# EAGLE design Shield_v2 (EAGLE 9.6.2)
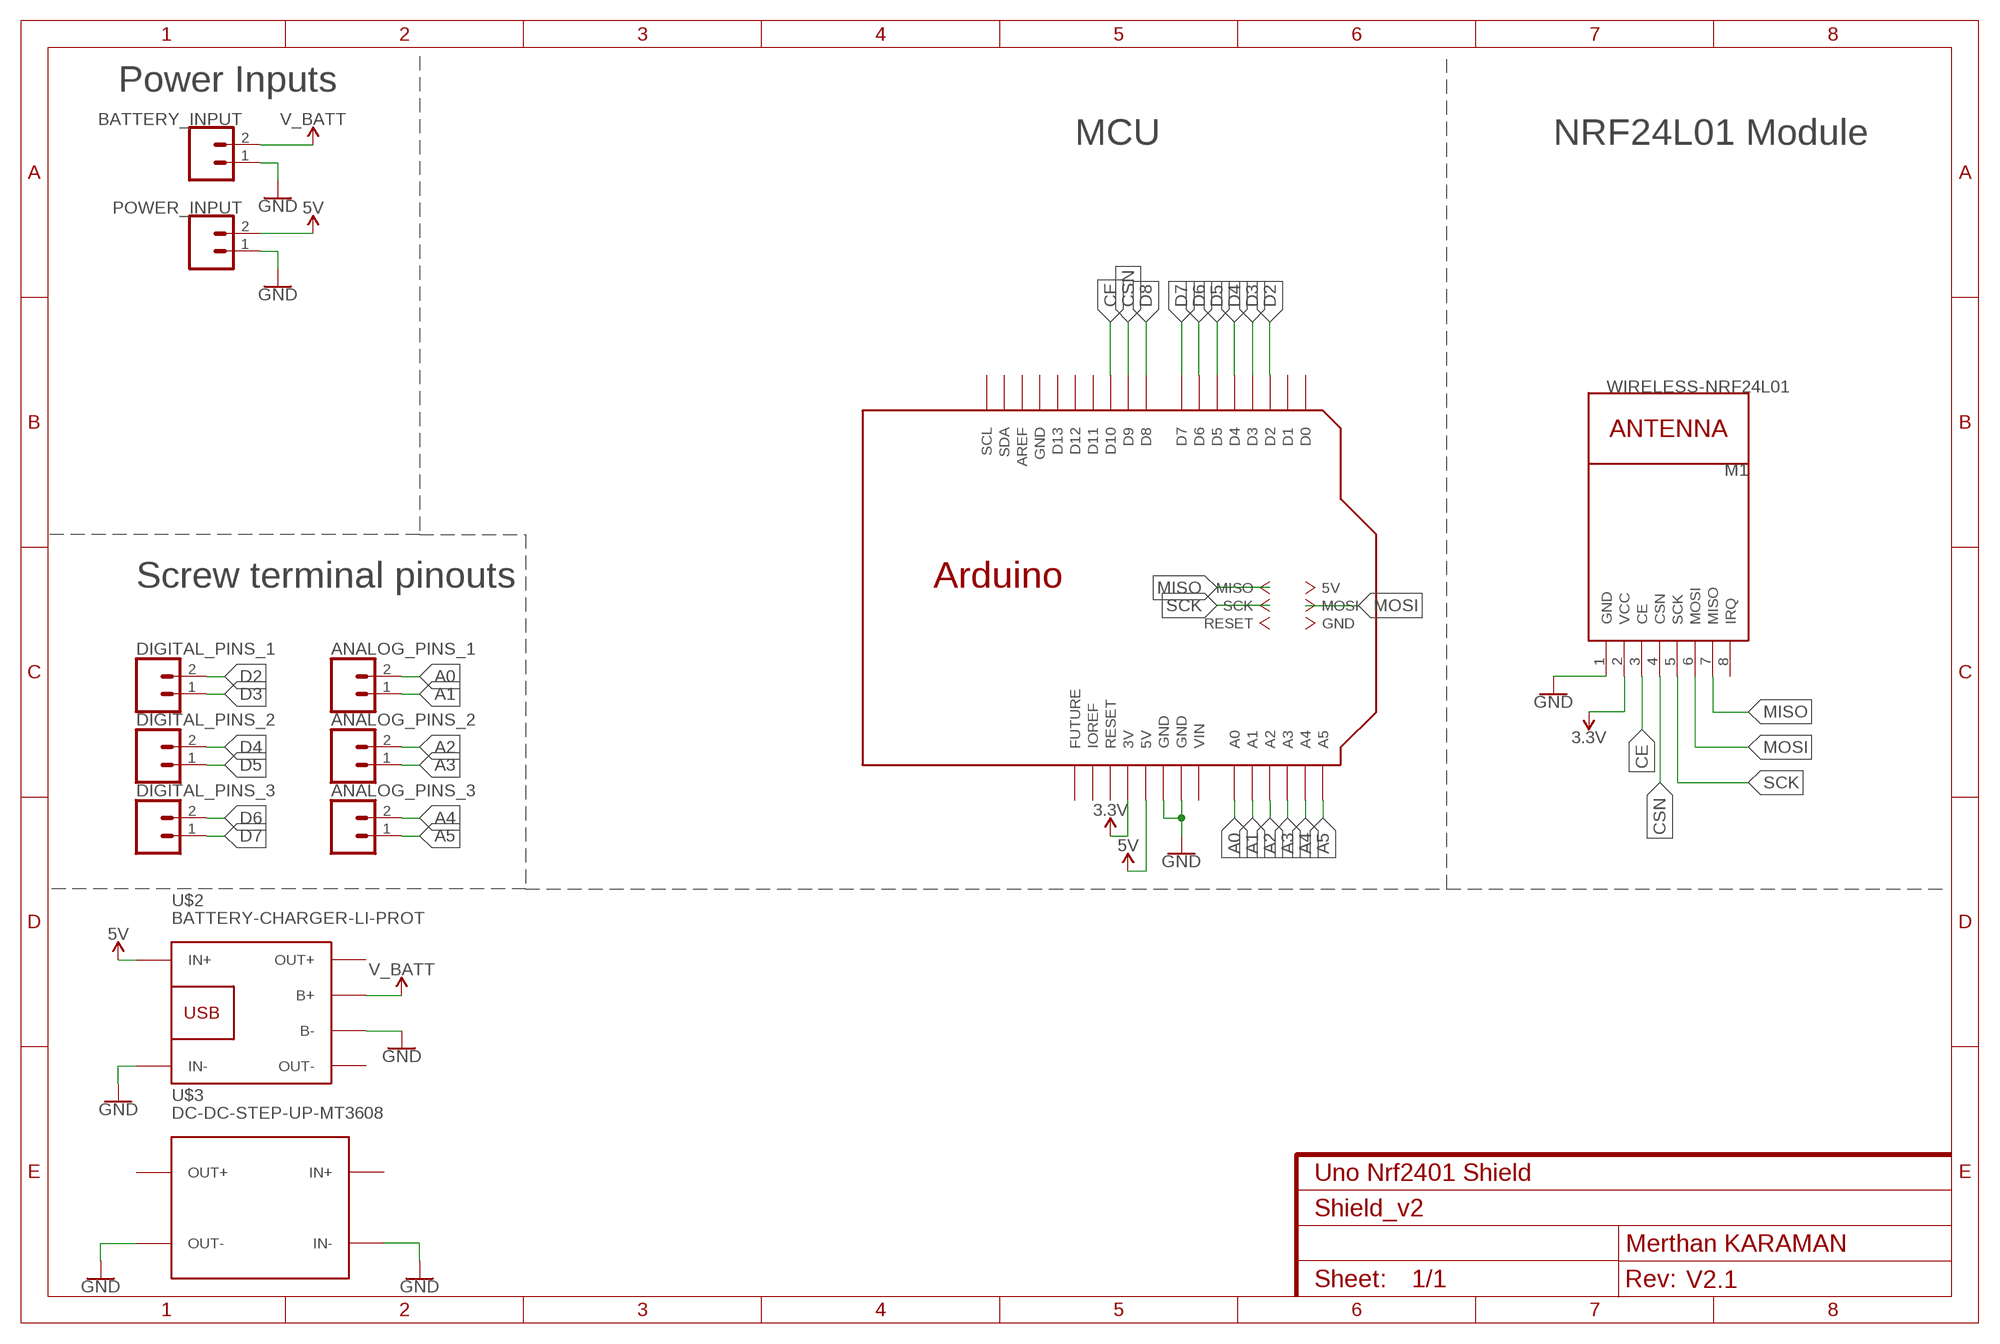
[diagram p0: schematic, sheet 1]
FRAME1 (FRAME-A4L): CNAME: Uno Nrf2401 Shield; CREVISION: V2.1; DESIGNER: Merthan KARAMAN

## Parts
ANALOG_PINS_1  CONN_025MM  [SCREWTERMINAL-5MM-2]
ANALOG_PINS_2  CONN_025MM  [SCREWTERMINAL-5MM-2]
ANALOG_PINS_3  CONN_025MM  [SCREWTERMINAL-5MM-2]
BATTERY_INPUT  CONN_025MM  [SCREWTERMINAL-5MM-2]
DIGITAL_PINS_1  CONN_025MM  [SCREWTERMINAL-5MM-2]
DIGITAL_PINS_2  CONN_025MM  [SCREWTERMINAL-5MM-2]
DIGITAL_PINS_3  CONN_025MM  [SCREWTERMINAL-5MM-2]
M1  WIRELESS-NRF24L01  [WIRELESS-NRF24L01]
POWER_INPUT  CONN_025MM  [SCREWTERMINAL-5MM-2]
U$1  ARDUINO-WITH-ISP  [ARDUINO-WITH-ISP]
U$2  BATTERY-CHARGER-LI-PROT  [BATTERY-CHARGER-LI-PROT]
U$3  DC-DC-STEP-UP-MT3608  [DC-DC-STEP-UP-MT3608]

## Nets
3.3V: M1.2(VCC) U$1.3V
5V: POWER_INPUT.2 U$1.5V U$2.IN+
A0: ANALOG_PINS_1.2 U$1.A0
A1: ANALOG_PINS_1.1 U$1.A1
A2: ANALOG_PINS_2.2 U$1.A2
A3: ANALOG_PINS_2.1 U$1.A3
A4: ANALOG_PINS_3.2 U$1.A4
A5: ANALOG_PINS_3.1 U$1.A5
CE: M1.3(CE) U$1.D10
CSN: M1.4(CSN) U$1.D9
D2: DIGITAL_PINS_1.2 U$1.D2
D3: DIGITAL_PINS_1.1 U$1.D3
D4: DIGITAL_PINS_2.2 U$1.D4
D5: DIGITAL_PINS_2.1 U$1.D5
D6: DIGITAL_PINS_3.2 U$1.D6
D7: DIGITAL_PINS_3.1 U$1.D7
D8: U$1.D8
GND: BATTERY_INPUT.1 M1.1(GND) POWER_INPUT.1 U$1.GND$2(GND) U$1.GND$3(GND) U$2.B- U$2.IN- U$3.IN- U$3.OUT-
MISO: M1.7(MISO) U$1.MISO
MOSI: M1.6(MOSI) U$1.MOSI
SCK: M1.5(SCK) U$1.SCK
V_BATT: BATTERY_INPUT.2 U$2.B+
Unconnected: M1.8(IRQ) U$1.5V@2(5V) U$1.AREF U$1.D0 U$1.D1 U$1.D11 U$1.D12 U$1.D13 U$1.GND@3(GND) U$1.IOREF U$1.RESERVED(FUTURE) U$1.RESET U$1.RESET@1(RESET) U$1.SCL U$1.SDA U$2.OUT+ U$2.OUT- U$3.IN+ U$3.OUT+

## Notes on the sheet
- Power Inputs
- MCU | NRF24L01 Module
- Screw terminal pinouts

## Power pins joined to a net without a drawn wire
GND: U$1.GND
VIN: U$1.VIN

## Library data of the parts
ANALOG_PINS_1-ANALOG_PINS_3 BATTERY_INPUT DIGITAL_PINS_1-DIGITAL_PINS_3 POWER_INPUT = SparkFun-Connectors:CONN_02: Multi connection point. Often used as Generic Header-pin footprint for 0.1 inch spaced/style header connections On any of the 0.1 inch spaced packages, you can populate with these: Break Away Headers - Straight <https://www.sparkfun.com/products/116> (PRT-00116) Break Away Male Headers - Right Angle <https://www.sparkfun.com/products/553> (PRT-00553) Female Headers <https://www.sparkfun.com/products/115> (PRT-00115) Break Away Headers - Machine Pin <https://www.sparkfun.com/products/117> (PRT-00117) Break Away Female Headers - Swiss Machine Pin <https://www.sparkfun.com/products/743> (PRT-00743) For SCREWTERMINALS and SPRING TERMINALS visit here: Screw Terimnals on SparkFun.com <https://www.sparkfun.com/search/results?term=Screw+Terminals> (5mm/3.5mm/2.54mm spacing) This device is also useful as a general connection point to wire up your design to another part of your project. Our various solder wires solder well into these plated through hole pads. Hook-Up Wire - Assortment (Stranded, 22 AWG) <https://www.sparkfun.com/products/11375> (PRT-11375) Hook-Up Wire - Assortment (Solid Core, 22 AWG) <https://www.sparkfun.com/products/11367> (PRT-11367) View the entire wire category on our website here <https://www.sparkfun.com/categories/141> Special notes: Molex polarized connector foot print use with: PRT-08233 with associated crimp pins and housings. 2.54_SCREWTERM for use with PRT-10571. 3.5mm Screw Terminal footprints for PRT-08084 5mm Screw Terminal footprints for use with PRT-08432; SF_SKU: PRT-08432
M1 = diy-modules:WIRELESS-NRF24L01: 2.4 GHz Wireless Module based on NRF24L01 chip More details available here: http://www.electrodragon.com/w/NRF24L01 Click here to find device on ebay.com <http://www.ebay.com/sch/nrf24l01+arduino>
U$1 = El_yapimi:ARDUINO-WITH-ISP
U$2 = diy-modules:BATTERY-CHARGER-LI-PROT: Lithium Battery 5V Charger with protection circuit More details available here: http://www.instructables.com/id/DIY-Lithium-ion-Battery-Charger/step4/TP4056-based-lithium-ion-battery-charger-module/ Click here to find device on ebay.com <http://www.ebay.com/sch/tp4056+charger+usb+protection>
U$3 = diy-modules:DC-DC-STEP-UP-MT3608: DC/DC Step-Up Regulator based on MT3608 chip MT3608 datasheet available here: https://www.olimex.com/Products/Breadboarding/BB-PWR-3608/resources/MT3608.pdf Click here to find device on ebay.com <http://www.ebay.com/sch/mt3608+module>

## Board
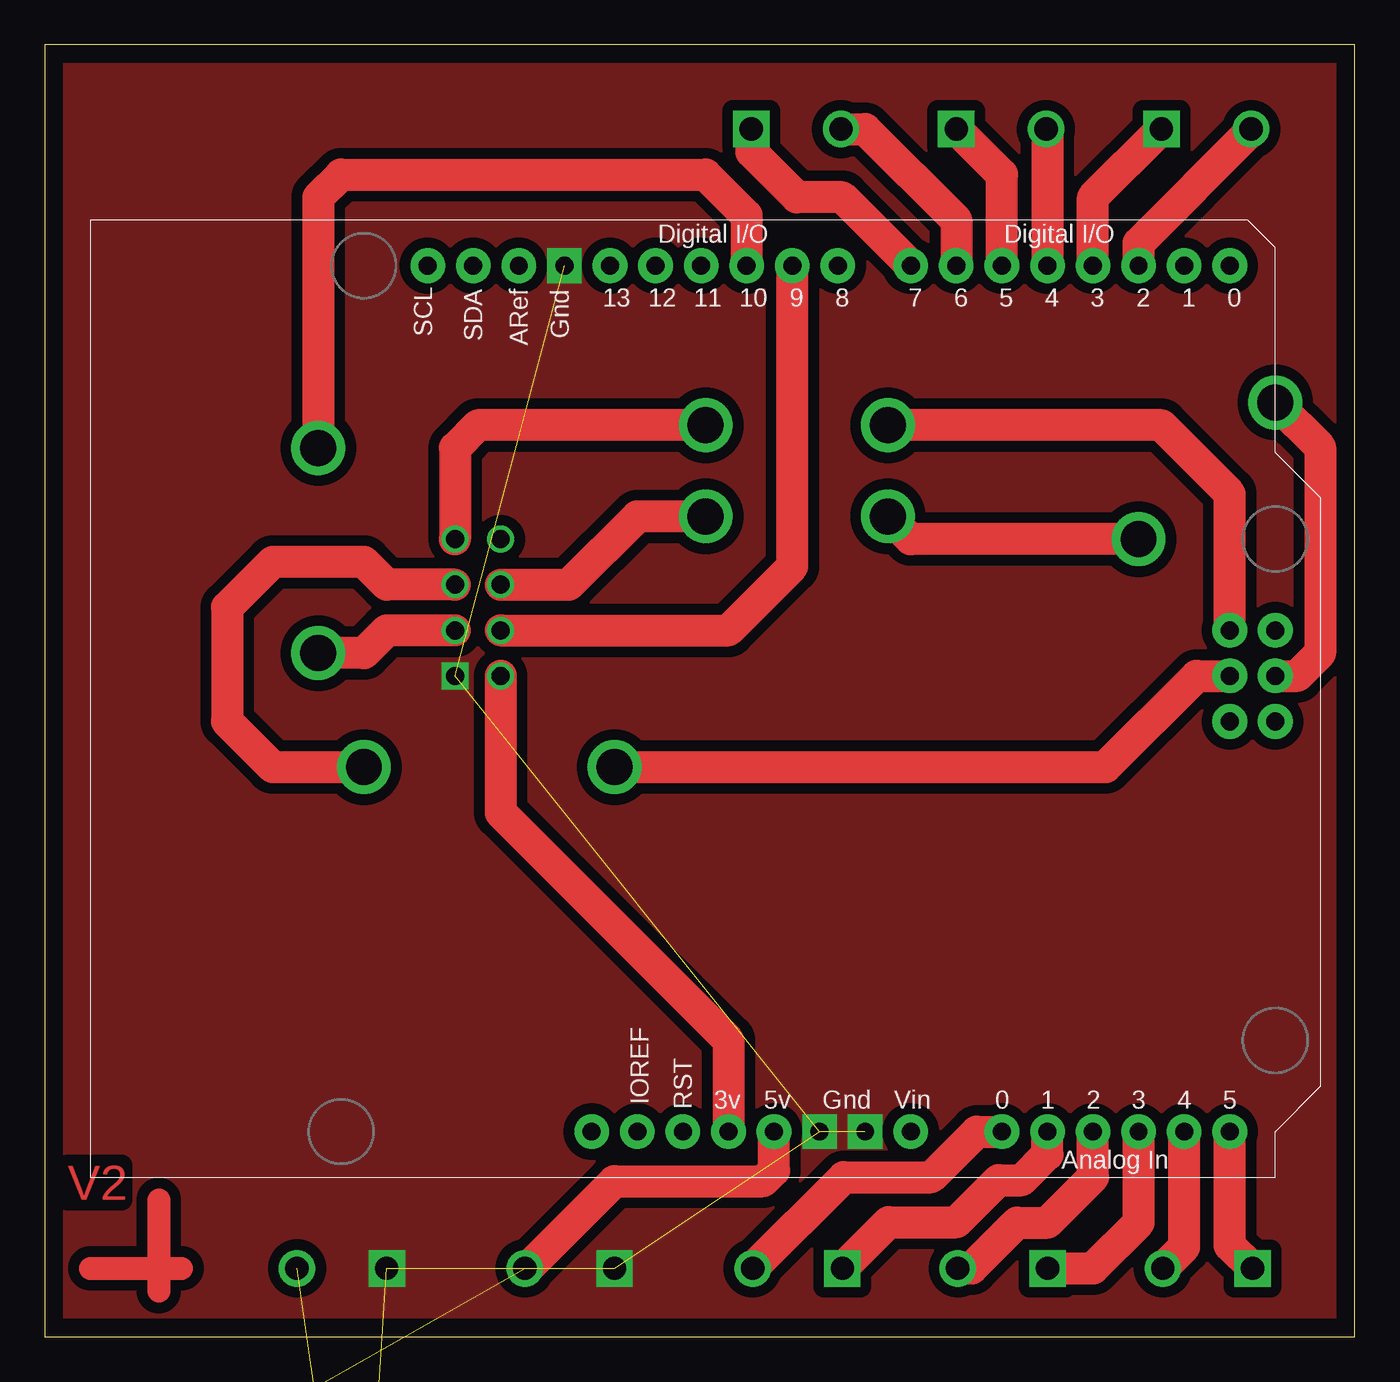
[diagram p1: board, top side]
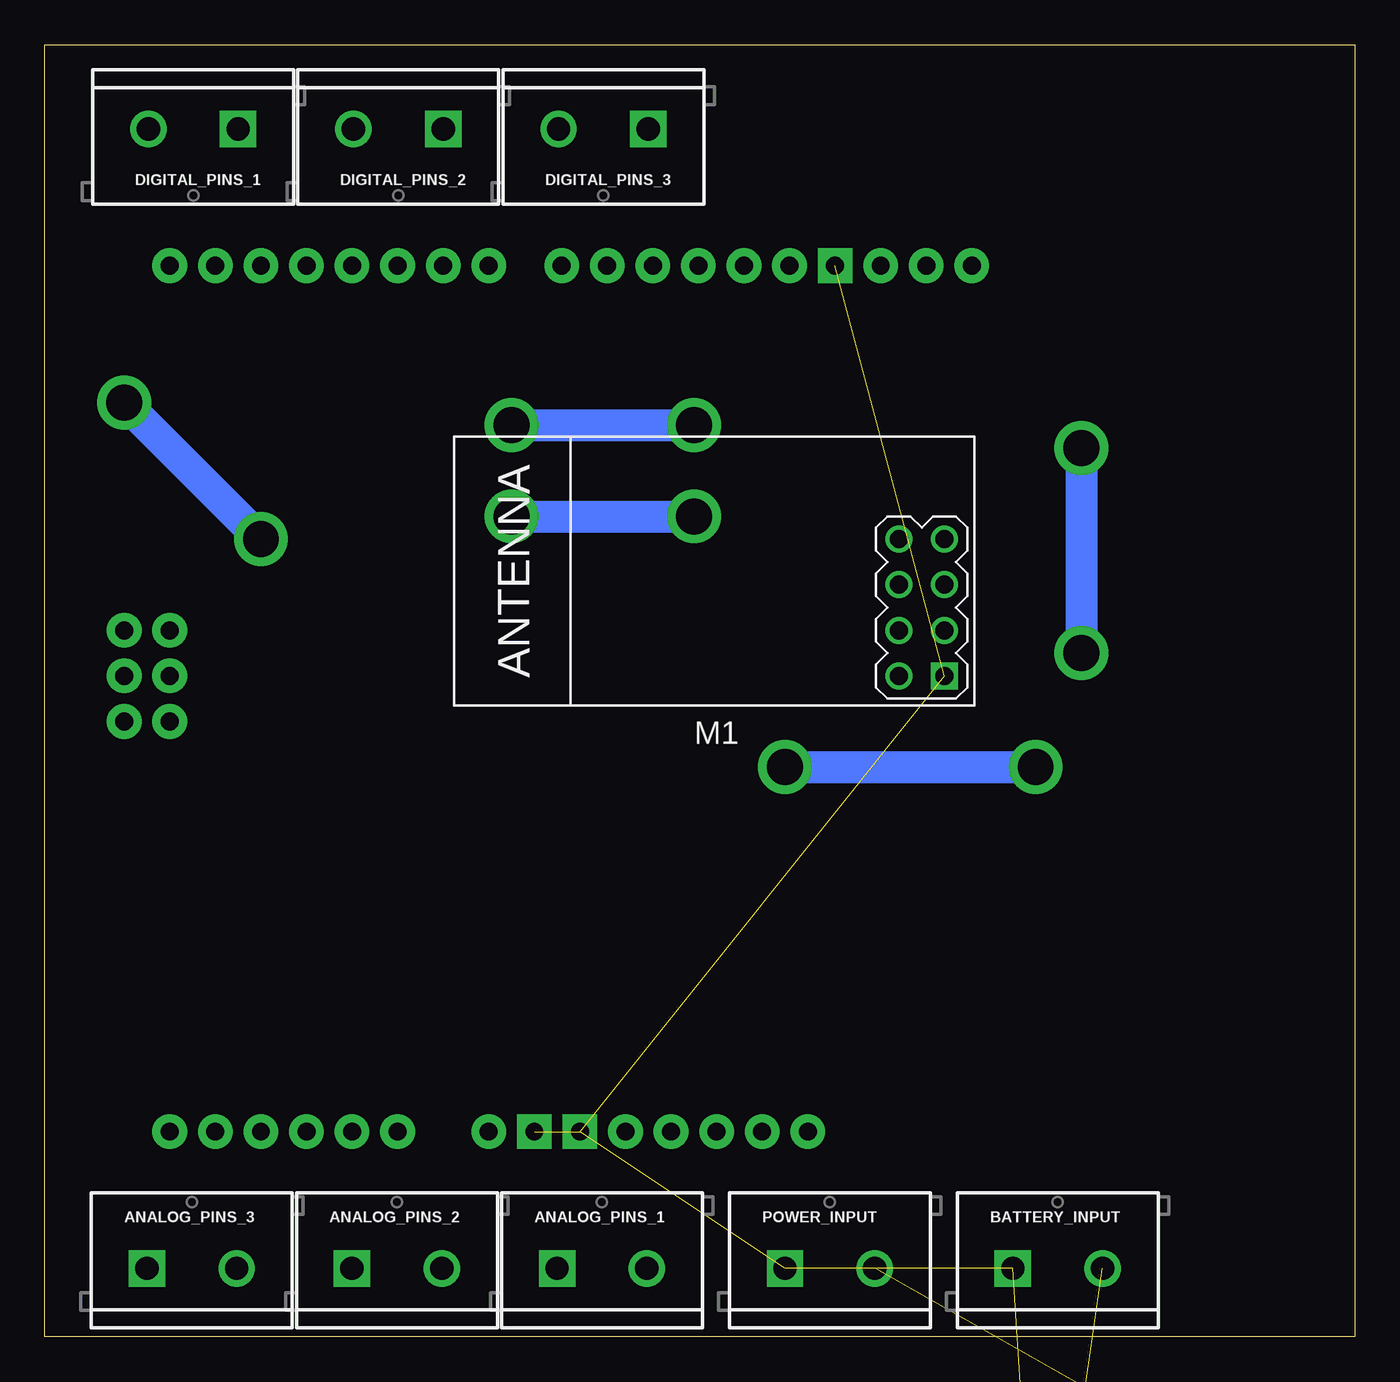
[diagram p2: board, bottom side, seen from below]

Size 73 x 72 mm. Coordinates in mm from the lower left corner, seen from the top.
Outline: 0,0 73,0 73,72 0,72 0,0
Copper layers (1*16): Top 0.035mm / dielectric 1.5mm / Bottom 0.035mm
Design rules "cnc_0.6_eagle_ayarlar": minimum track width 6mil, minimum drill 0.35mm, track to track 0.6mm, track to pad 0.6mm, pad to pad 0.6mm, via to via 0.6mm, smd to smd 0.6mm, copper to edge 40mil, drill to drill 0.6mm, minimum pad ring 10mil, minimum via ring 8mil, stop-mask expansion 4mil, vias tented up to drill 0mil, thermal gap 0.6mm

### Footprints (pad centres in the part's own frame; a part is rotated, then mirrored left to right if it is on the bottom)
SCREWTERMINAL-5MM-2 = drill 1.3 pad 2.032 square: 1 0,0 | drill 1.3 pad 2.032: 2 5,0
WIRELESS-NRF24L01 = drill 1 square: 1 -12.7,6.35 | drill 1: 2 -10.16,6.35; 3 -12.7,3.81; 4 -10.16,3.81; 5 -12.7,1.27; 6 -10.16,1.27; 7 -12.7,-1.27; 8 -10.16,-1.27
ARDUINO-WITH-ISP = drill 1 pad 1.93: 3V 1.27,-24.13; 5V 3.81,-24.13; 5V@2 31.75,3.81; A0 16.51,-24.13; A1 19.05,-24.13; A2 21.59,-24.13; A3 24.13,-24.13; A4 26.67,-24.13; A5 29.21,-24.13; AREF -10.414,24.13; D0 29.21,24.13; D1 26.67,24.13; D2 24.13,24.13; D3 21.59,24.13; D4 19.05,24.13; D5 16.51,24.13; D6 13.97,24.13; D7 11.43,24.13; D8 7.366,24.13; D9 4.826,24.13; D10 2.286,24.13; D11 -0.254,24.13; D12 -2.794,24.13; D13 -5.334,24.13; GND@3 31.75,-1.27; IOREF -3.81,-24.13; MISO 29.21,3.81; MOSI 31.75,1.27; RESERVED -6.35,-24.13; RESET -1.27,-24.13; RESET@1 29.21,-1.27; SCK 29.21,1.27; SCL -15.494,24.13; SDA -12.954,24.13; VIN 11.43,-24.13 | drill 1 pad 1.93 square: GND -7.874,24.13; GND$2 8.89,-24.13; GND$3 6.35,-24.13
BATTERY-CHARGER-LI-PROT = drill 1.2 pad 2.5 square: B+ 10.795,3.81; B- 10.795,-3.81; IN+ -12.065,6.985; IN- -12.065,-6.985; OUT+ 10.795,6.985; OUT- 10.795,-6.985
DC-DC-STEP-UP-MT3608 = drill 2 pad 2.8 square: IN+ 15.24,3.81; IN- 15.24,-3.81; OUT+ -15.24,3.81; OUT- -15.24,-3.81

### Placement (x,y rotation side)
ANALOG_PINS_1  44.45,3.81 0 bottom
ANALOG_PINS_2  55.88,3.81 0 bottom
ANALOG_PINS_3  67.31,3.81 0 bottom
BATTERY_INPUT  19.05,3.81 0 bottom
DIGITAL_PINS_1  62.23,67.31 180 bottom
DIGITAL_PINS_2  50.8,67.31 180 bottom
DIGITAL_PINS_3  39.37,67.31 180 bottom
M1  35.56,43.18 180 bottom
POWER_INPUT  31.75,3.81 0 bottom
U$1  36.83,35.56 0 top
U$2  6.35,-21.59 0 top  (outside the outline)
U$3  8.89,-45.72 0 top  (outside the outline)

### Tracks (layer width: path | path; a pad name or v marks a point on that pad's centre or on a via)
3.3V
  Top 1.778: U$1.3V 38.1,16.51 25.4,29.21 M1.2
5V  (1 unrouted)
  Top 1.27: POWER_INPUT.2 26.9,3.81
  Top 1.778: U$1.5V 40.64,9.27 40.03,8.66 31.75,8.66 26.9,3.81
A0
  Top 1.778: ANALOG_PINS_1.2 44.53,8.89 49.4,8.89 51.94,11.43 U$1.A0
A1
  Top 1.778: ANALOG_PINS_1.1 47.02,6.38 50.81,6.38 53.15,8.73 54.45,8.73 55.88,10.16 U$1.A1
A2
  Top 1.778: ANALOG_PINS_2.2 51.64,3.81 54.18,6.35 55.88,6.35 58.42,8.89 U$1.A2
A3
  Top 1.778: ANALOG_PINS_2.1 58.42,3.81 60.96,6.35 U$1.A3
A4
  Top 1.778: ANALOG_PINS_3.2 63.5,5 U$1.A4
A5
  Top 1.778: ANALOG_PINS_3.1 66.04,5.08 U$1.A5
CE  (via drill 2)
  Top 1.778: U$1.D10 39.12,62.48 36.83,64.77 16.51,64.77 15.24,63.5 v15.24,49.53 | M1.3 19.05,39.37 17.78,38.1 v15.24,38.1
  Bottom 1.778: v15.24,49.53 v15.24,38.1
CSN
  Top 1.778: M1.4 38.1,39.37 41.66,42.93 U$1.D9
D2
  Top 1.778: U$1.D2 60.96,60.96 67.23,67.23 DIGITAL_PINS_1.2
D3
  Top 1.778: U$1.D3 58.42,63.5 DIGITAL_PINS_1.1
D4
  Top 1.778: DIGITAL_PINS_2.2 55.88,67.23 U$1.D4
D5
  Top 1.778: U$1.D5 53.34,64.77 DIGITAL_PINS_2.1
D6
  Top 1.778: DIGITAL_PINS_3.2 45.72,67.31 50.8,62.23 U$1.D6
D7
  Top 1.778: DIGITAL_PINS_3.1 39.37,66.04 41.91,63.5 44.45,63.5 U$1.D7
GND  (9 unrouted)
  pour Top (no thermals): -1.27,73.66 -1.27,-1.27 74.93,-1.27 74.93,73.66
MISO  (via drill 2)
  Top 1.778: U$1.MISO 66.04,46.99 62.23,50.8 v46.99,50.8 | M1.7 22.86,49.53 24.13,50.8 v36.83,50.8
  Bottom 1.778: v46.99,50.8 v36.83,50.8
MOSI  (via drill 2)
  Top 1.778: M1.6 29.21,41.91 33.02,45.72 v36.83,45.72 | v60.96,44.45 48.26,44.45 v46.99,45.72 | v68.58,52.07 71.08,49.57 71.08,38.1 69.81,36.83 U$1.MOSI
  Bottom 1.778: v60.96,44.45 v68.58,52.07 | v46.99,45.72 v36.83,45.72
N$7
  Top 1.27: 2.54,3.81 7.62,3.81
N$8
  Top 1.27: 6.35,7.62 6.35,2.54
SCK  (via drill 2)
  Top 1.778: v31.75,31.75 59.12,31.75 64.2,36.83 U$1.SCK | M1.5 19.05,41.91 17.78,43.18 12.7,43.18 10.16,40.64 10.16,34.29 12.7,31.75 v17.78,31.75
  Bottom 1.778: v31.75,31.75 v17.78,31.75
V_BATT  (1 unrouted)

### Text on the board
Top: V2